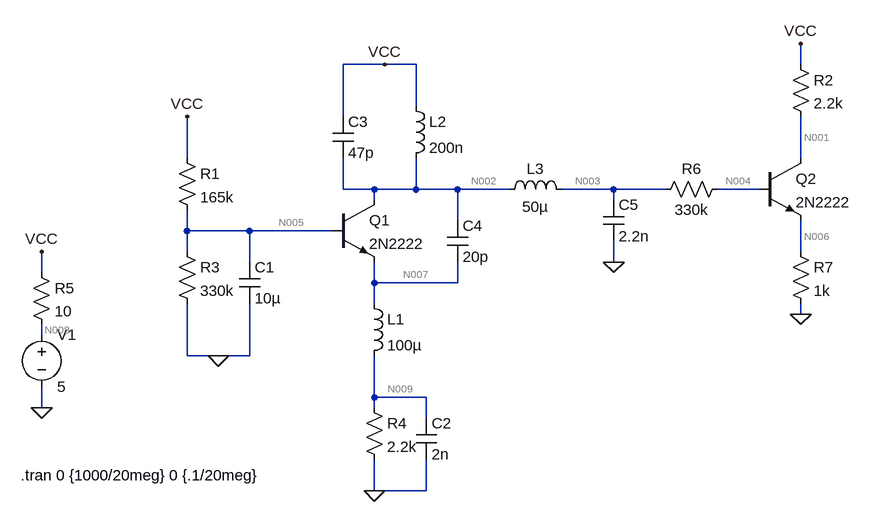
[diagram p0: schematic Super-regen.asc]
Super-regen.asc, the LTspice schematic file:
Version 4
SHEET 1 1464 756
WIRE 448 -80 384 -80
WIRE 496 -80 448 -80
WIRE 1088 -80 1088 -112
WIRE 496 -16 496 -80
WIRE 384 0 384 -80
WIRE 144 64 144 0
WIRE 1088 64 1088 0
WIRE 384 112 384 64
WIRE 432 112 384 112
WIRE 496 112 496 64
WIRE 496 112 432 112
WIRE 560 112 496 112
WIRE 640 112 560 112
WIRE 800 112 720 112
WIRE 880 112 800 112
WIRE 1024 112 960 112
WIRE 432 128 432 112
WIRE 800 128 800 112
WIRE 560 160 560 112
WIRE 144 176 144 144
WIRE 240 176 144 176
WIRE 368 176 240 176
WIRE 144 208 144 176
WIRE 1088 208 1088 160
WIRE 240 224 240 176
WIRE 800 224 800 192
WIRE -80 240 -80 208
WIRE 432 256 432 224
WIRE 560 256 560 224
WIRE 560 256 432 256
WIRE 432 288 432 256
WIRE 1088 304 1088 288
WIRE -80 336 -80 320
WIRE 144 368 144 288
WIRE 192 368 144 368
WIRE 240 368 240 288
WIRE 240 368 192 368
WIRE 432 432 432 368
WIRE 512 432 432 432
WIRE -80 448 -80 416
WIRE 432 448 432 432
WIRE 512 464 512 432
WIRE 432 576 432 528
WIRE 512 576 512 528
WIRE 512 576 432 576
FLAG 432 576 0
FLAG -80 448 0
FLAG -80 208 VCC
FLAG 448 -80 VCC
FLAG 144 0 VCC
FLAG 192 368 0
FLAG 800 224 0
FLAG 1088 304 0
FLAG 1088 -112 VCC
SYMBOL res 128 48 R0
SYMATTR InstName R1
SYMATTR Value 165k
SYMBOL res 128 192 R0
SYMATTR InstName R3
SYMATTR Value 330k
SYMBOL cap 224 224 R0
SYMATTR InstName C1
SYMATTR Value 10µ
SYMBOL npn 368 128 R0
SYMATTR InstName Q1
SYMATTR Value 2N2222
SYMBOL res 416 432 R0
SYMATTR InstName R4
SYMATTR Value 2.2k
SYMBOL cap 496 464 R0
SYMATTR InstName C2
SYMATTR Value 2n
SYMBOL ind 416 272 R0
SYMATTR InstName L1
SYMATTR Value 100µ
SYMBOL ind 480 -32 R0
SYMATTR InstName L2
SYMATTR Value 200n
SYMBOL cap 368 0 R0
SYMATTR InstName C3
SYMATTR Value 47p
SYMBOL voltage -80 320 R0
WINDOW 123 0 0 Left 0
WINDOW 39 0 0 Left 0
SYMATTR InstName V1
SYMATTR Value 5
SYMBOL res -96 224 R0
SYMATTR InstName R5
SYMATTR Value 10
SYMBOL cap 544 160 R0
SYMATTR InstName C4
SYMATTR Value 20p
SYMBOL ind 624 128 R270
WINDOW 0 32 56 VTop 2
WINDOW 3 5 56 VBottom 2
SYMATTR InstName L3
SYMATTR Value 50µ
SYMBOL cap 784 128 R0
SYMATTR InstName C5
SYMATTR Value 2.2n
SYMBOL res 976 96 R90
WINDOW 0 0 56 VBottom 2
WINDOW 3 32 56 VTop 2
SYMATTR InstName R6
SYMATTR Value 330k
SYMBOL npn 1024 64 R0
SYMATTR InstName Q2
SYMATTR Value 2N2222
SYMBOL res 1072 -96 R0
SYMATTR InstName R2
SYMATTR Value 2.2k
SYMBOL res 1072 192 R0
SYMATTR InstName R7
SYMATTR Value 1k
TEXT -112 552 Left 2 !.tran 0 {1000/20meg} 0 {.1/20meg}

The netlist it stands for:
* Super-regen.asc
R1 VCC N005 165k
R3 N005 0 330k
C1 N005 0 10µ
Q1 N002 N005 N007 0 2N2222
R4 N009 0 2.2k
C2 N009 0 2n
L1 N007 N009 100µ
L2 VCC N002 200n
C3 VCC N002 47p
V1 N008 0 5
R5 VCC N008 10
C4 N002 N007 20p
L3 N002 N003 50µ
C5 N003 0 2.2n
R6 N004 N003 330k
Q2 N001 N004 N006 0 2N2222
R2 VCC N001 2.2k
R7 N006 0 1k
.model NPN NPN
.model PNP PNP
.lib standard.bjt
.tran 0 {1000/20meg} 0 {.1/20meg}
.backanno
.end

* Results of the author's LTspice run, read from the files saved beside the schematic
* Operating Point, zero values left out:
*   V(vcc) = 4.975 V
*   V(n005) = 2.794 V
*   V(n002) = 4.975 V
*   V(n007) = 2.14 V
*   V(n009) = 2.14 V
*   V(n008) = 5 V
*   V(n003) = 4.975 V
*   V(n004) = 2.175 V
*   V(n001) = 1.674 V
*   V(n006) = 1.509 V
*   Ic(Q1) = 968 µA
*   Ib(Q1) = 4.752 µA
*   Ie(Q1) = -972.7 µA
*   Ic(Q2) = 1.501 mA
*   Ib(Q2) = 8.484 µA
*   Ie(Q2) = -1.509 mA
*   I(L1) = 972.7 µA
*   I(L2) = 976.5 µA
*   I(L3) = 8.484 µA
*   I(R1) = 13.22 µA
*   I(R3) = 8.467 µA
*   I(R4) = 972.7 µA
*   I(R5) = -2.49 mA
*   I(R6) = -8.484 µA
*   I(R2) = 1.501 mA
*   I(R7) = 1.509 mA
*   I(V1) = -2.49 mA